# Altium schematic sheet GIC.SchDoc
size A4
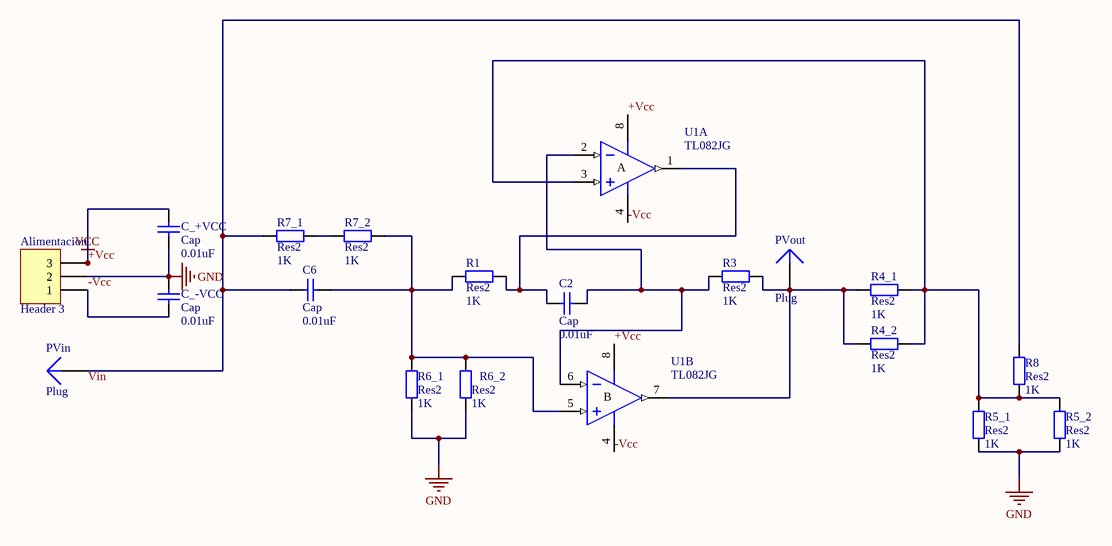
[diagram p0: GIC.SchDoc]

## Parts
Alimentacion  Header 3  [HDR1X3]
C2  Cap  value 0.01uF  [RAD-0.3]
C6  Cap  value 0.01uF  [RAD-0.3]
C_+VCC  Cap  value 0.01uF  [RAD-0.3]
C_-VCC  Cap  value 0.01uF  [RAD-0.3]
PVin  Plug  [PIN1]
PVout  Plug  [PIN1]
R1  Res2  value 1K  [AXIAL-0.4]
R3  Res2  value 1K  [AXIAL-0.4]
R4_1  Res2  value 1K  [AXIAL-0.4]
R4_2  Res2  value 1K  [AXIAL-0.4]
R5_1  Res2  value 1K  [AXIAL-0.4]
R5_2  Res2  value 1K  [AXIAL-0.4]
R6_1  Res2  value 1K  [AXIAL-0.4]
R6_2  Res2  value 1K  [AXIAL-0.4]
R7_1  Res2  value 1K  [AXIAL-0.4]
R7_2  Res2  value 1K  [AXIAL-0.4]
R8  Res2  value 1K  [AXIAL-0.4]
U1  TL082JG  [JG008]  (parts A,B of 2)

## Nets
+Vcc: Alimentacion.3 C_+VCC.2 U1.8(V+)  [also labelled VCC]
GND: Alimentacion.2 C_+VCC.1 C_-VCC.2 R5_1.1 R5_2.1 R6_1.1 R6_2.1
-Vcc: Alimentacion.1 C_-VCC.1 U1.4(V-)
NetC2_1: C2.1 R1.2 U1.1(OUT)
NetC2_2: C2.2 R3.1 U1.2(IN-) U1.6(IN-)
NetC6_1: C6.1 R1.1 R6_1.2 R6_2.2 R7_2.2 U1.5(IN+)
NetC6_2: C6.2 PVin.1 R7_1.1 R8.2
NetPVout_1: PVout.1 R3.2 R4_1.1 R4_2.1 U1.7(OUT)
NetR4_1_2: R4_1.2 R4_2.2 R5_1.2 R5_2.2 R8.1 U1.3(IN+)
NetR7_1_2: R7_1.2 R7_2.1

## Notes on the sheet
- Labels drawn without touching a wire or pin: Vin
- (in symbol TL082JG, part A) A
- (in symbol TL082JG, part B) B

## Library data of the parts
Alimentacion = Header 3: Header, 3-Pin; LatestRevisionDate: 17-Jul-2002; LatestRevisionNote: Re-released for DXP Platform.; Publisher: Altium Limited
C2 C6 C_+VCC C_-VCC = Cap: Capacitor; Published: 8-Jun-2000; LatestRevisionDate: 17-Jul-2002; LatestRevisionNote: Re-released for DXP Platform.; PackageReference: RAD-0.3; Publisher: Altium Limited; PackageDescription: Radial Cap, Thru-Hole; 2 Leads; 0.3 in Pin Spacing
R1 R3 R4_1 R4_2 R5_1 R5_2 R6_1 R6_2 R7_1 R7_2 R8 = Res2: Resistor; Published: 8-Jun-2000; LatestRevisionDate: 17-Jul-2002; LatestRevisionNote: Re-released for DXP Platform.; PackageReference: AXIAL-0.4; Publisher: Altium Limited; PackageDescription: Axial Device, Thru-Hole; 2 Leads; 0.4 in Pin Spacing
U1 = TL082JG: JFET-Input Operational Amplifier; Published: 16-Jan-2001; LatestRevisionDate: 04-Mar-2005; LatestRevisionNote: Stylized 3D Model Added.; DatasheetVersion: Feb-1999; PackageVersion: Jan-1995; PackageReference: JG008; Publisher: Altium Limited; PackageDescription: DIP; 8 Leads; Row Spacing 7.62 mm; Pitch 2.54 mm; ComponentLink1Description: Manufacturer Link; ComponentLink1URL: http://www.ti.com/; ComponentLink2Description: Datasheet; ComponentLink2URL: http://www-s.ti.com/sc/ds/tl082.pdf
PVin PVout = Plug: LatestRevisionDate: 17-Jul-2002; LatestRevisionNote: Re-released for DXP Platform.; Publisher: Altium Limited